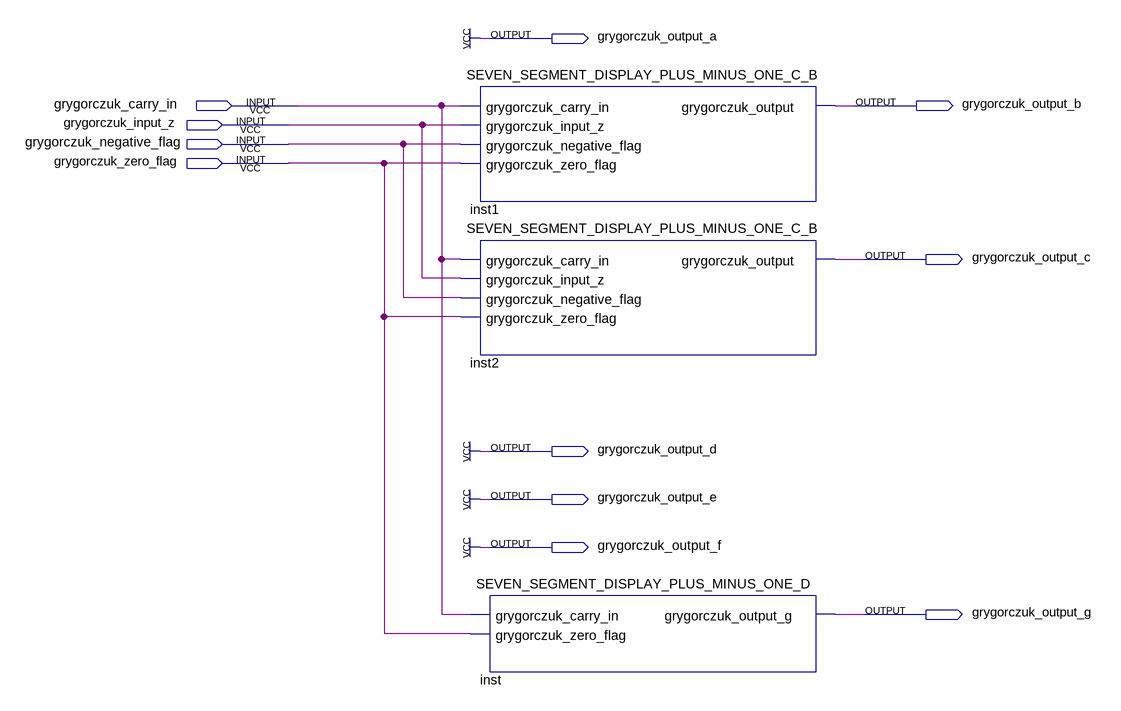
[diagram p0: schematic sheet]
// Quartus schematic SEVEN_SEGMENT_DISPLAY_PLUS_MINUS_ONE.bdf as structural Verilog: 3 symbols, 11 pins
module SEVEN_SEGMENT_DISPLAY_PLUS_MINUS_ONE (
  input  grygorczuk_carry_in,
  input  grygorczuk_input_z,
  input  grygorczuk_negative_flag,
  input  grygorczuk_zero_flag,
  output grygorczuk_output_a,
  output grygorczuk_output_b,
  output grygorczuk_output_c,
  output grygorczuk_output_d,
  output grygorczuk_output_e,
  output grygorczuk_output_f,
  output grygorczuk_output_g
);

  SEVEN_SEGMENT_DISPLAY_PLUS_MINUS_ONE_C_B inst1 (
    .grygorczuk_carry_in(grygorczuk_carry_in), .grygorczuk_input_z(grygorczuk_input_z),
    .grygorczuk_negative_flag(grygorczuk_negative_flag), .grygorczuk_zero_flag(grygorczuk_zero_flag),
    .grygorczuk_output(grygorczuk_output_b));
  SEVEN_SEGMENT_DISPLAY_PLUS_MINUS_ONE_C_B inst2 (
    .grygorczuk_carry_in(grygorczuk_carry_in), .grygorczuk_input_z(grygorczuk_input_z),
    .grygorczuk_negative_flag(grygorczuk_negative_flag), .grygorczuk_zero_flag(grygorczuk_zero_flag),
    .grygorczuk_output(grygorczuk_output_c));
  SEVEN_SEGMENT_DISPLAY_PLUS_MINUS_ONE_D inst (
    .grygorczuk_carry_in(grygorczuk_carry_in), .grygorczuk_zero_flag(grygorczuk_zero_flag),
    .grygorczuk_output_g(grygorczuk_output_g));

  assign grygorczuk_output_a = 1'b1;
  assign grygorczuk_output_d = 1'b1;
  assign grygorczuk_output_e = 1'b1;
  assign grygorczuk_output_f = 1'b1;
endmodule
